# EAGLE design vescom (EAGLE 6.3)
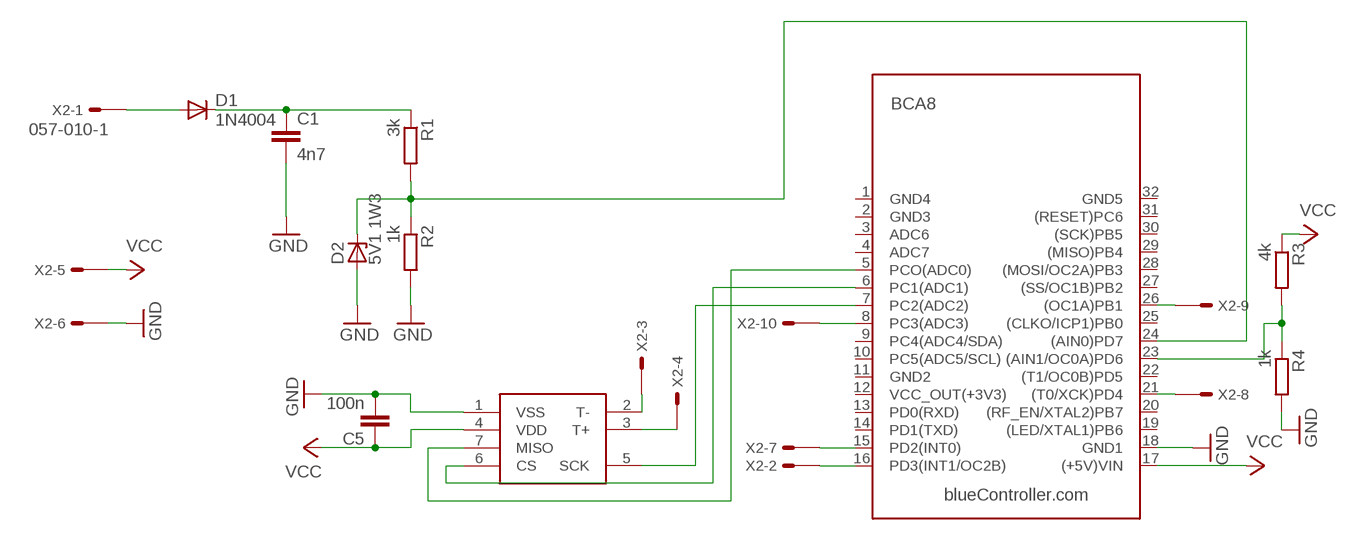
[diagram p0: schematic, sheet 1]

## Parts
C1  4n7  C-EU025-025X050  [C025-025X050]
C5  100n  C-EU025-025X050  [C025-025X050]
D1  1N4004  [DO41-10]
D2  5V1 1W3  ZENER-DIODEDO34-7  [DO34Z7]
MAX6675  MAX6675  [SO08]
R1  3k  R-EU_0207/10  [0207/10]
R2  1k  R-EU_0207/10  [0207/10]
R3  4k  R-EU_0207/10  [0207/10]
R4  1k  R-EU_0207/10  [0207/10]
U$1  BC  [BC]
X2  057-010-1  [057-010-1]

## Nets
EGT_CK: MAX6675.5(SCK) U$1.7(PC2(ADC2))
EGT_CS: MAX6675.6(CS) U$1.6(PC1(ADC1))
EGT_MISO: MAX6675.7(MISO) U$1.5(PCO(ADC0))
GND: C1.2 C5.2 D2.A MAX6675.1(VSS) R2.2 R4.2 U$1.18(GND1) X2.6
LICHTMASCHINE: D1.A X2.1
N$1: U$1.21((T0/XCK)PD4) X2.8
N$2: C1.1 D1.C R1.1
N$3: U$1.16(PD3(INT1/OC2B)) X2.2
N$4: U$1.15(PD2(INT0)) X2.7
N$5: R3.2 R4.1 U$1.23((AIN1/OC0A)PD6)
N$7: U$1.26((OC1A)PB1) X2.9
PC3: U$1.8(PC3(ADC3)) X2.10
RPM_Q: D2.C R1.2 R2.1 U$1.24((AIN0)PD7)
T+: MAX6675.3(T+) X2.4
T-: MAX6675.2(T-) X2.3
VCC: C5.1 MAX6675.4(VDD) R3.1 U$1.17((+5V)VIN) X2.5
Unconnected: U$1.1(GND4) U$1.2(GND3) U$1.3(ADC6) U$1.4(ADC7) U$1.9(PC4(ADC4/SDA)) U$1.10(PC5(ADC5/SCL)) U$1.11(GND2) U$1.12(VCC_OUT(+3V3)) U$1.13(PD0(RXD)) U$1.14(PD1(TXD)) U$1.19((LED/XTAL1)PB6) U$1.20((RF_EN/XTAL2)PB7) U$1.22((T1/OC0B)PD5) U$1.25((CLKO/ICP1)PB0) U$1.27((SS/OC1B)PB2) U$1.28((MOSI/OC2A)PB3) U$1.29((MISO)PB4) U$1.30((SCK)PB5) U$1.31((RESET)PC6) U$1.32(GND5)

## Library data of the parts
C1 C5 = rcl:C-EU: CAPACITOR, European symbol
D1 = diode:1N4004: DIODE general purpose rectifier, 1 A
D2 = diode:ZENER-DIODE: Z-Diode
MAX6675 = max6675:MAX6675
R1-R4 = rcl:R-EU_: RESISTOR, European symbol
U$1 = bluecontroller:BC
X2 = con-panduit:057-010-: CONNECTOR 10-pin series 057 contact pc board low profile headers; OC_FARNELL: unknown; OC_NEWARK: unknown

## Board
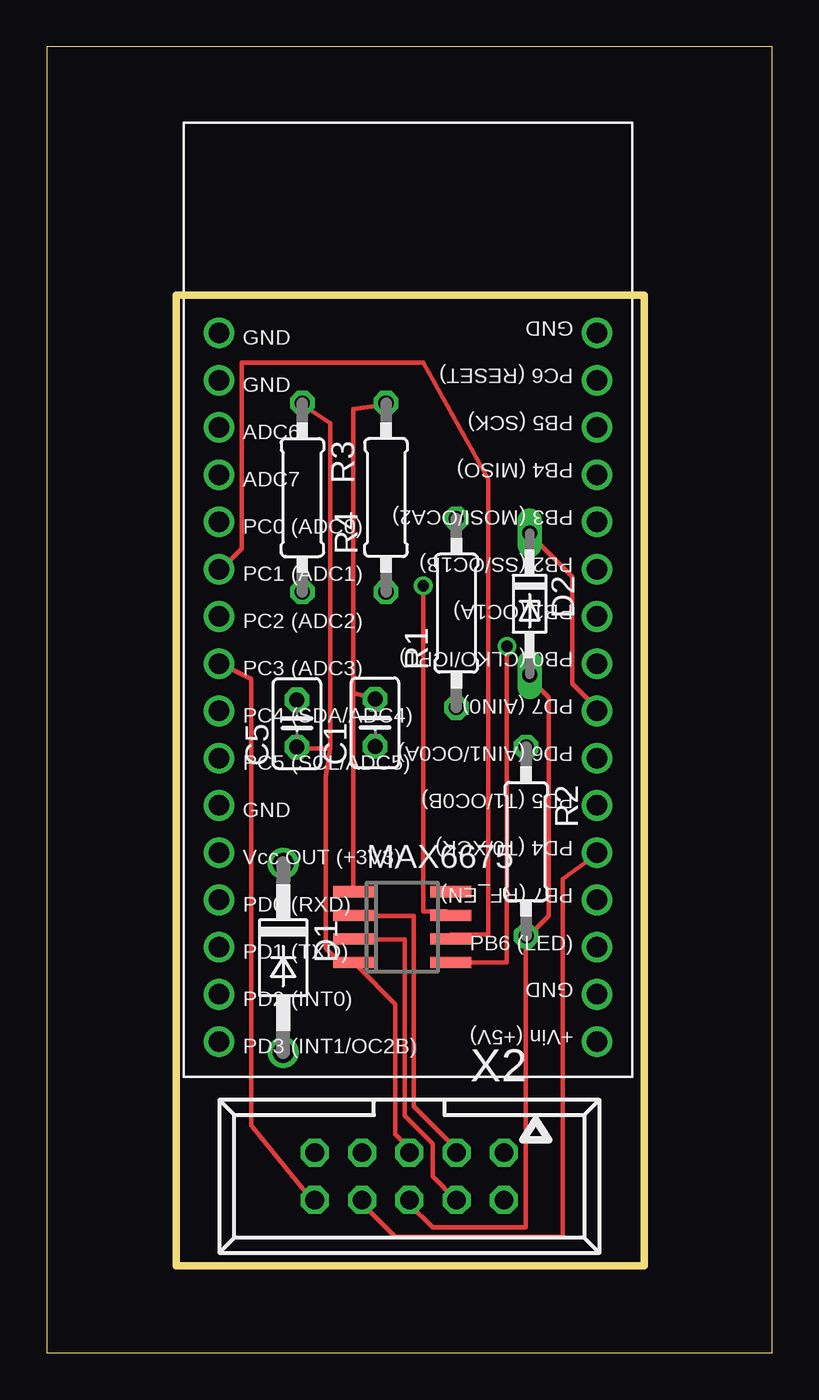
[diagram p1: board, top side]
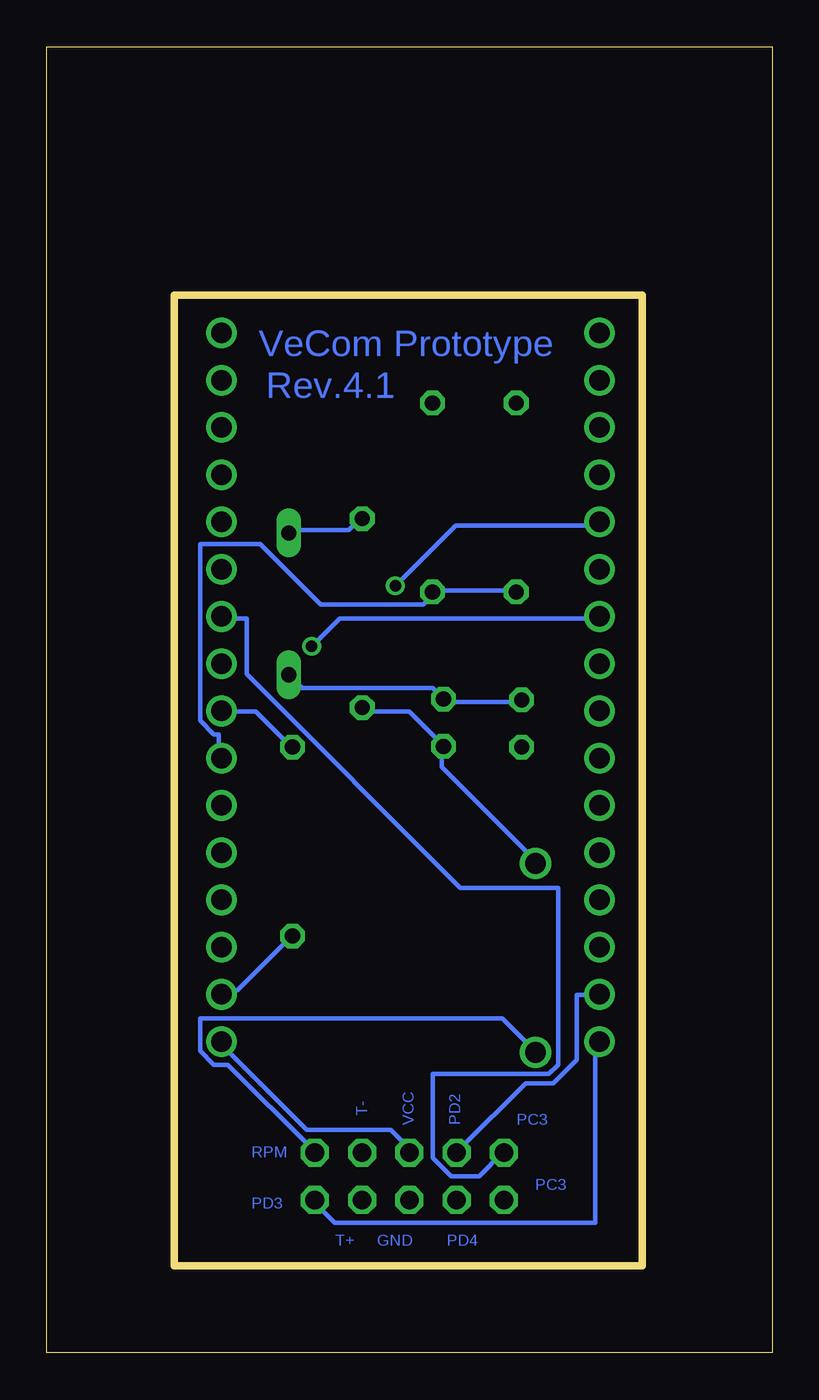
[diagram p2: board, bottom side, seen from below]

Size 39 x 70.25 mm. Coordinates in mm from the lower left corner, seen from the top.
Outline: 0,0 39,0 39,70.25 0,70.25 0,0
Outline: 6.98,56.89 32.13,56.89 32.13,4.68 6.98,4.68 6.98,56.89
Copper layers (1*16): Top 0.035mm / dielectric 1.5mm / Bottom 0.035mm
Design rules "default": minimum track width 10mil, minimum drill 24mil, track to track 8mil, track to pad 8mil, pad to pad 8mil, via to via 8mil, smd to smd 8mil, copper to edge 40mil, drill to drill 8mil, minimum pad ring 10mil, minimum via ring 8mil, stop-mask expansion 4mil, vias tented up to drill 0mil, thermal gap 10mil

### Footprints (pad centres in the part's own frame; a part is rotated, then mirrored left to right if it is on the bottom)
C025-025X050 = drill 0.813 octagon: 1 -1.27,0; 2 1.27,0
DO41-10 = drill 1.118: A 5.08,0; C -5.08,0
DO34Z7 = drill 0.813 long: A 3.81,0; C -3.81,0
SO08 = smd 0.6 x 2.2: 1 -1.905,-2.6; 2 -0.635,-2.6; 3 0.635,-2.6; 4 1.905,-2.6; 5 1.905,2.6; 6 0.635,2.6; 7 -0.635,2.6; 8 -1.905,2.6
0207/10 = drill 0.813 octagon: 1 -5.08,0; 2 5.08,0
BC = drill 1.1: 1 15.875,10.16; 2 13.335,10.16; 3 10.795,10.16; 4 8.255,10.16; 5 5.715,10.16; 6 3.175,10.16; 7 0.635,10.16; 8 -1.905,10.16; 9 -4.445,10.16; 10 -6.985,10.16; 11 -9.525,10.16; 12 -12.065,10.16; 13 -14.605,10.16; 14 -17.145,10.16; 15 -19.685,10.16; 16 -22.225,10.16; 17 -22.225,-10.16; 18 -19.685,-10.16; 19 -17.145,-10.16; 20 -14.605,-10.16; 21 -12.065,-10.16; 22 -9.525,-10.16; 23 -6.985,-10.16; 24 -4.445,-10.16; 25 -1.905,-10.16; 26 0.635,-10.16; 27 3.175,-10.16; 28 5.715,-10.16; 29 8.255,-10.16; 30 10.795,-10.16; 31 13.335,-10.16; 32 15.875,-10.16
057-010-1 = drill 1 octagon: 1 -5.08,-1.27; 2 -5.08,1.27; 3 -2.54,-1.27; 4 -2.54,1.27; 5 0,-1.27; 6 0,1.27; 7 2.54,-1.27; 8 2.54,1.27; 9 5.08,-1.27; 10 5.08,1.27

### Placement (x,y rotation side)
C1  17.66,33.89 90 top
C5  13.46,33.85 90 top
D1  12.72,21.25 270 top
D2  25.97,40.28 270 top
MAX6675  19.12,22.9 270 top
R1  22.03,39.78 90 top
R2  25.78,27.5 270 top
R3  13.75,46 270 top
R4  18.25,46 90 top
U$1  19.43,38.97 90 top
X2  19.5,9.5 180 top

### Tracks (layer width: path | path; a pad name or v marks a point on that pad's centre or on a via)
EGT_CK  (via drill 0.61)
  Top 0.254: v24.75,38 24.75,21 21.75,21 MAX6675.5
  Bottom 0.254: v24.75,38 23.25,39.5 9.5,39.5 U$1.7
EGT_CS
  Top 0.254: MAX6675.6 21.75,22.5 23.75,22.5 23.75,47 20.25,53.25 10.5,53.25 10.5,43.25 9.5,42.25 U$1.6
EGT_MISO  (via drill 0.61)
  Top 0.254: v20.25,41.25 20.25,23.75 21.5,23.75 MAX6675.7
  Bottom 0.254: v20.25,41.25 17,44.5 9.5,44.5 U$1.5
GND
  Top 0.254: X2.6 19.5,8 20.75,6.75 25.75,6.75 25.75,22.25 R2.2 26,22.5 27,23.5 27,35.25 26,36.25 D2.A | 16.5,35.5 16.5,25 MAX6675.1 | 16.5,35.5 C1.2 17.5,35 | 16.5,35.5 16.5,50.75 18.25,51 R4.2
  Bottom 0.254: R2.2 26,22.25 28.75,19.5 29.5,19.5 U$1.18 | C5.2 13.5,35 17.5,35 C1.2 18.25,35.75 25.25,35.75 D2.A
LICHTMASCHINE
  Bottom 0.254: X2.1 24.75,11 29.25,15.5 30,15.5 30.75,16.25 30.75,18 14.5,18 12.75,16.25 D1.A
N$1
  Top 0.254: X2.8 17,8 18.75,6.25 27.75,6.25 27.75,25.5 29.5,26.75 U$1.21
N$2
  Bottom 0.254: R1.1 22,34.5 19.5,34.5 17.75,32.75 C1.1 17.75,32.5 17.75,31.5 12.75,26.5 D1.C
N$3
  Bottom 0.254: X2.2 24.5,8 23.5,7 9.5,7 9.5,16.5 U$1.16
N$4
  Bottom 0.254: X2.7 16.75,11 13.25,14.5 11.75,14.5 10.5,15.75 10.5,19.25 9.5,19.25 U$1.15
N$5
  Bottom 0.254: R3.2 13.75,41 18.25,41 R4.1 18.25,40.75 18.75,40.25 24.25,40.25 27.5,43.5 30.75,43.5 30.75,34 30,33.25 29.75,33.25 29.75,32 U$1.23
N$7
  Bottom 0.254: X2.9 14.5,10.75 15.75,9.5 17.25,9.5 18.25,10.5 18.25,15 12,15 11.5,15.5 11.5,25 16.75,25 28.25,36.5 28.25,39.5 29.5,39.5 U$1.26
PC3
  Top 0.254: X2.10 14.25,8.25 11,12.25 11,36.25 9.5,37 U$1.8
RPM_Q
  Top 0.254: D2.C 26,44 28.25,41.75 28.25,36 29.5,34.75 U$1.24
  Bottom 0.254: R1.2 22.25,44.75 22.75,44.25 25.75,44.25 D2.C | R2.1 26,32.75 27.75,34.5 29.5,34.5 U$1.24
T+
  Top 0.254: MAX6675.3 16.75,22.25 19.25,22.25 19.25,12.75 20.75,11.25 20.75,9.5 22,8.25 X2.4
T-
  Top 0.254: MAX6675.2 16.75,23.5 19.75,23.5 19.75,13.25 22,11 X2.3
VCC
  Top 0.254: X2.5 19.5,11 18.75,11.75 18.75,18.75 16.75,20.75 MAX6675.4 16.5,21 15.75,21 15,21.75 15,31 15.25,32.5 | 15.25,32.5 13.5,32.5 C5.1 | 15.25,32.5 15.25,50 13.75,51 R3.1
  Bottom 0.254: U$1.17 29.5,16.5 25,12 20.5,12 19.5,11 X2.5

### Text on the board
Bottom: VeCom Prototype | Rev.4.1 | T- | PC3 | PD2 | VCC | RPM | PC3 | PD3 | PD4 | GND | T+